# Altium project AD9777.PrjPcb
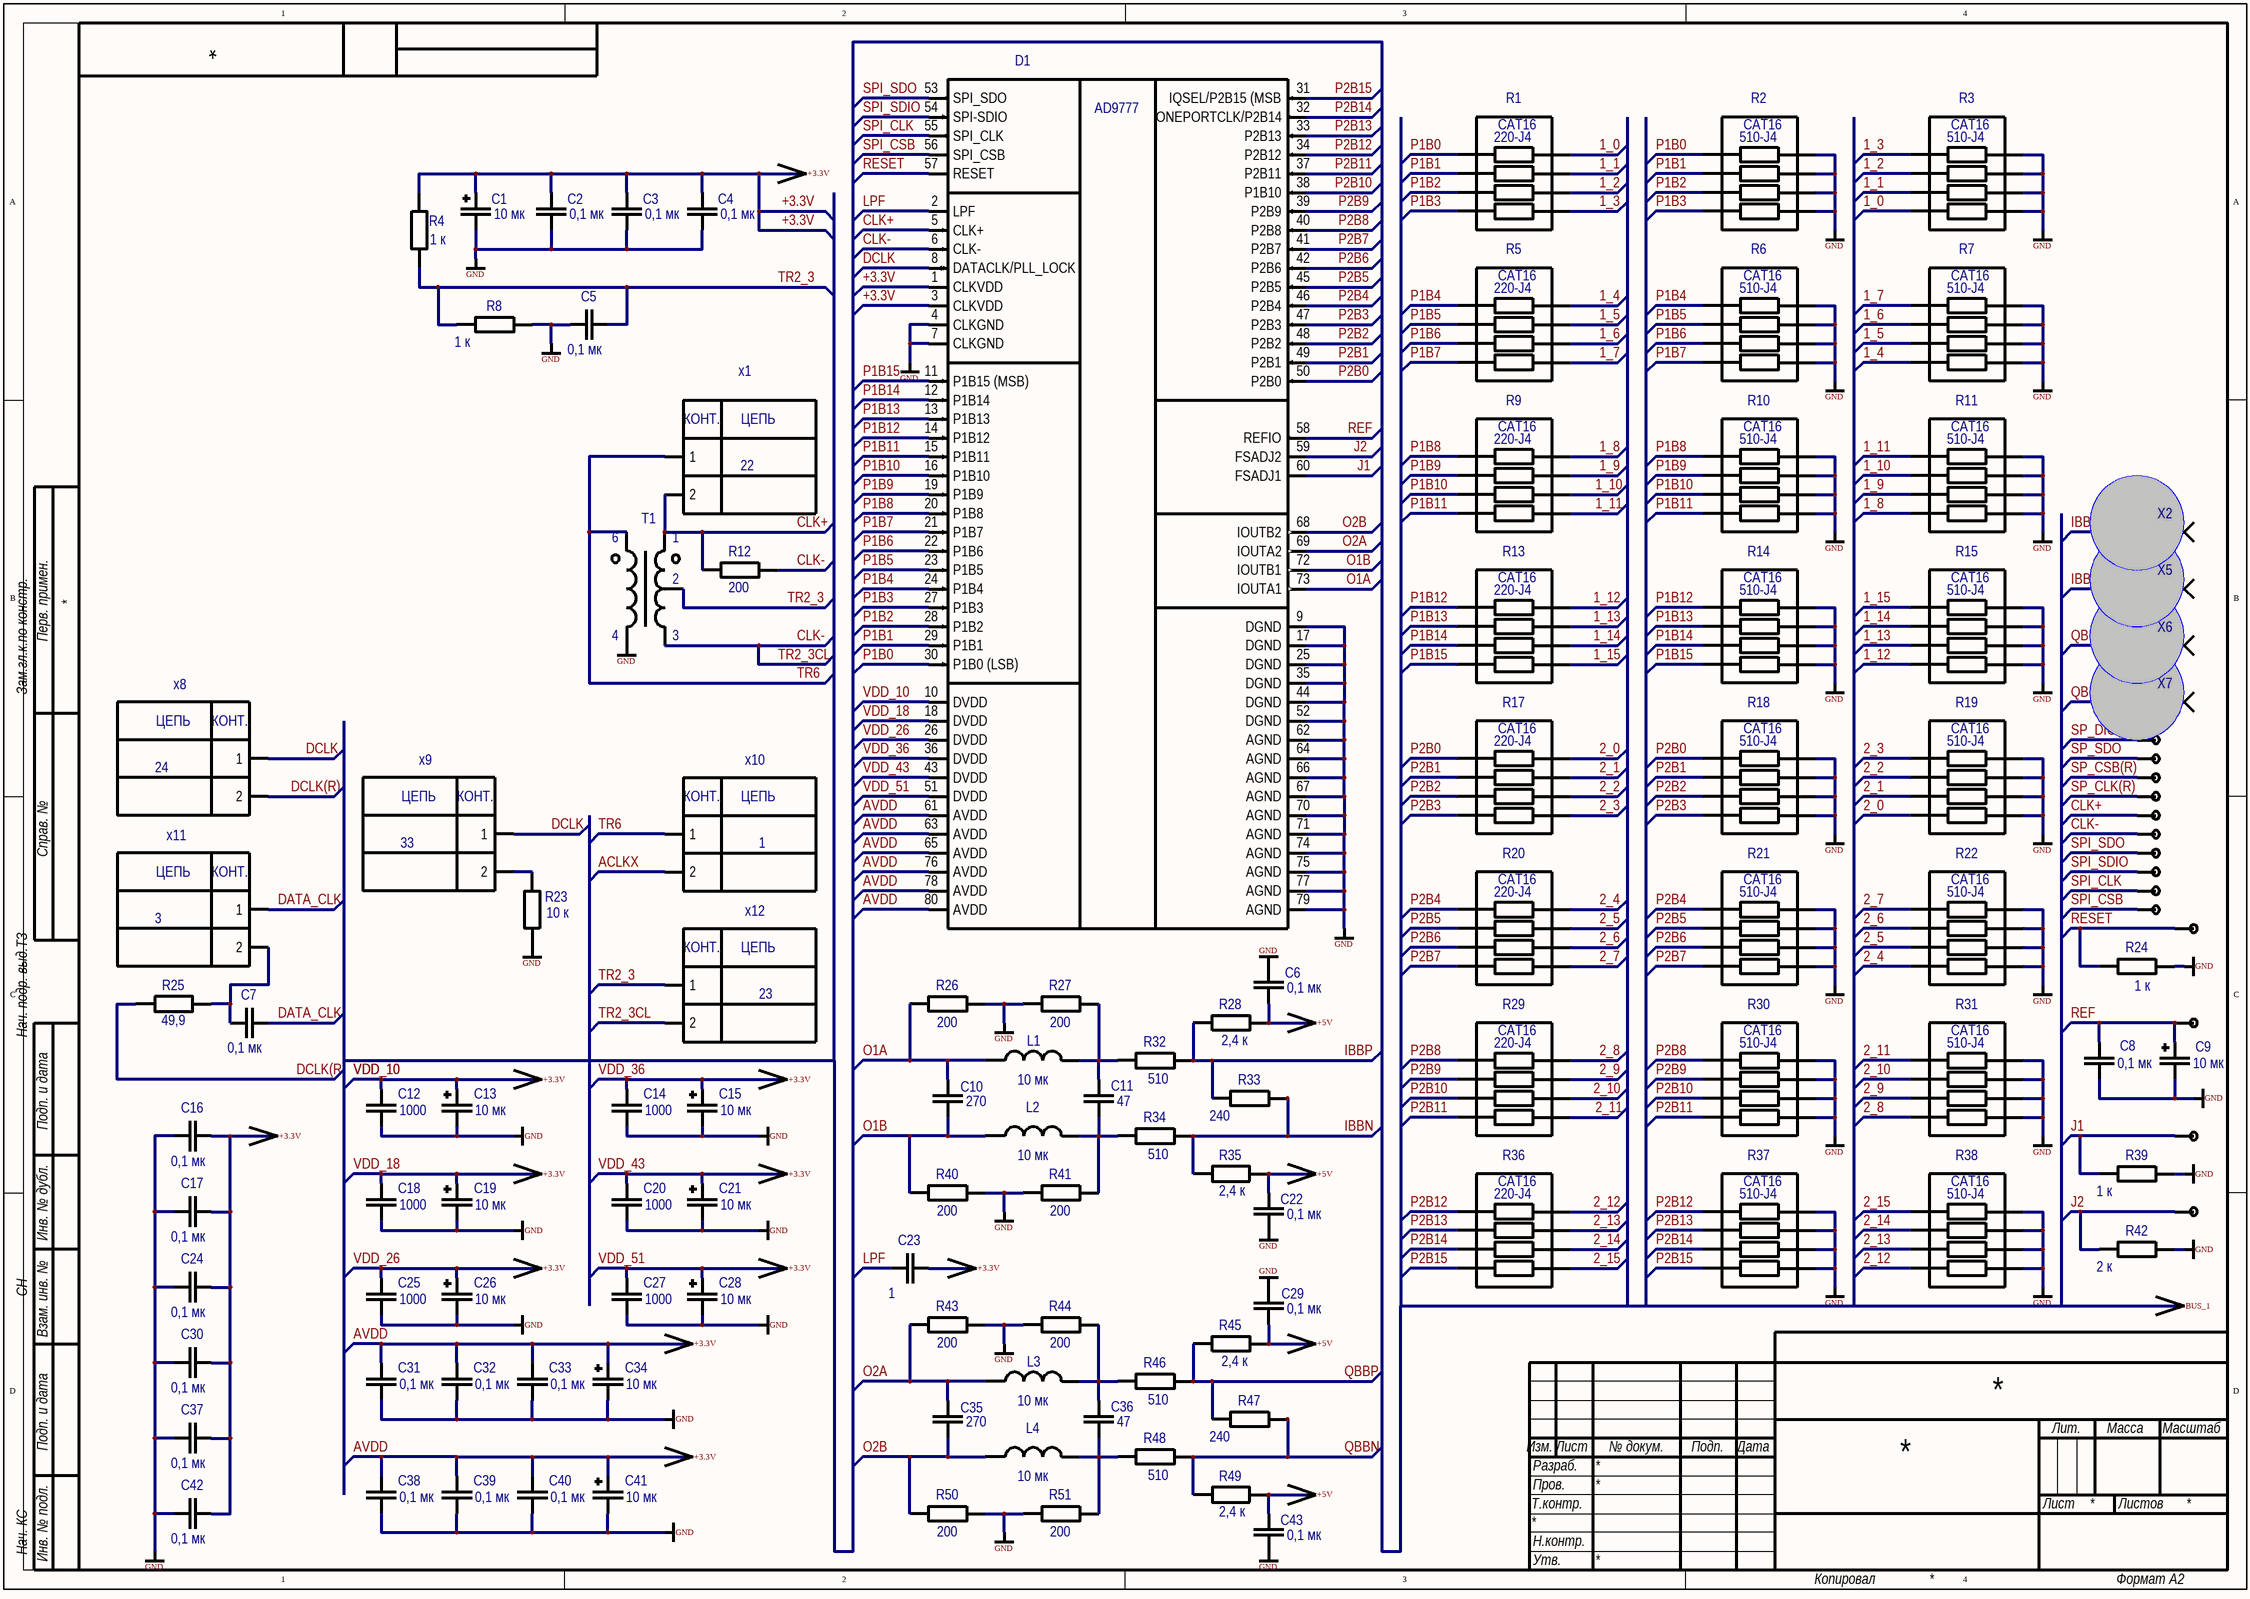
[diagram p0: AD9777.SchDoc]
3 sheets, 235 parts. Net scope: global (net labels, ports and power ports of the same name join across sheets).
Board file: AD9777.PcbDoc
Sheets:
  AD9777.SchDoc
  AD9777(2).SchDoc
  AD9777(3).SchDoc

## Sheet AD9777.SchDoc
size 594 x 420 mm

### Parts
(Parts that share a designator on the sheet are numbered #1, #2 ... from top to bottom, then left to right.)
*?#1  VCC  (value not drawn)  (graphical)
*?#2  GND  (value not drawn)  (graphical)
*?#3  GND  (value not drawn)  (graphical)
*?#4  GND  (value not drawn)  (graphical)
*?#5  GND  (value not drawn)  (graphical)
*?#6  GND  (value not drawn)  (graphical)
*?#7  GND  (value not drawn)  (graphical)
*?#8  GND  (value not drawn)  (graphical)
*?#9  GND  (value not drawn)  (graphical)
*?#10  GND  (value not drawn)  (graphical)
*?#11  GND  (value not drawn)  (graphical)
*?#12  GND  (value not drawn)  (graphical)
*?#13  GND  (value not drawn)  (graphical)
*?#14  GND  (value not drawn)  (graphical)
*?#15  GND  (value not drawn)  (graphical)
*?#16  GND  (value not drawn)  (graphical)
*?#17  GND  (value not drawn)  (graphical)
*?#18  GND  (value not drawn)  (graphical)
*?#19  GND  (value not drawn)  (graphical)
*?#20  GND  (value not drawn)  (graphical)
*?#21  GND  (value not drawn)  (graphical)
*?#22  GND  (value not drawn)  (graphical)
*?#23  VCC  (value not drawn)  (graphical)
*?#24  VCC  (value not drawn)  (graphical)
*?#25  VCC  (value not drawn)  (graphical)
*?#26  GND  (value not drawn)  (graphical)
*?#27  VCC  (value not drawn)  (graphical)
*?#28  GND  (value not drawn)  (graphical)
*?#29  GND  (value not drawn)  (graphical)
*?#30  GND  (value not drawn)  (graphical)
*?#31  GND  (value not drawn)  (graphical)
*?#32  VCC  (value not drawn)  (graphical)
*?#33  VCC  (value not drawn)  (graphical)
*?#34  VCC  (value not drawn)  (graphical)
*?#35  GND  (value not drawn)  (graphical)
*?#36  GND  (value not drawn)  (graphical)
*?#37  GND  (value not drawn)  (graphical)
*?#38  GND  (value not drawn)  (graphical)
*?#39  GND  (value not drawn)  (graphical)
*?#40  GND  (value not drawn)  (graphical)
*?#41  VCC  (value not drawn)  (graphical)
*?#42  VCC  (value not drawn)  (graphical)
*?#43  VCC  (value not drawn)  (graphical)
*?#44  GND  (value not drawn)  (graphical)
*?#45  GND  (value not drawn)  (graphical)
*?#46  GND  (value not drawn)  (graphical)
*?#47  VCC  (value not drawn)  (graphical)
*?#48  GND  (value not drawn)  (graphical)
*?#49  GND  (value not drawn)  (graphical)
*?#50  VCC  (value not drawn)  (graphical)
*?#51  GND  (value not drawn)  (graphical)
*?#52  VCC  (value not drawn)  (graphical)
*?#53  GND  (value not drawn)  (graphical)
*?#54  VCC  (value not drawn)  (graphical)
*?#55  VCC  (value not drawn)  (graphical)
*?#56  GND  (value not drawn)  (graphical)
*?#57  GND  (value not drawn)  (graphical)
*?#58  GND  (value not drawn)  (graphical)
*?#59  GND  (value not drawn)  (graphical)
C1  10 мк  [TC3528-1411]
C2  0,1 мк  [CAPC1608L]
C3  0,1 мк  [CAPC1608L]
C4  0,1 мк  [CAPC1608L]
C5  0,1 мк  [CAPC1608L]
C6  0,1 мк  [CAPC1608L]
C7  0,1 мк  [CAPC1608L]
C8  0,1 мк  [CAPC1608L]
C9  10 мк  [TC3528-1411]
C10  270  [CAPC1608L]
C11  47  [CAPC1608L]
C12  1000  [CAPC1608L]
C13  10 мк  [TC3528-1411]
C14  1000  [CAPC1608L]
C15  10 мк  [TC3528-1411]
C16  0,1 мк  [CAPC2012L]
C17  0,1 мк  [CAPC2012L]
C18  1000  [CAPC1608L]
C19  10 мк  [TC3528-1411]
C20  1000  [CAPC1608L]
C21  10 мк  [TC3528-1411]
C22  0,1 мк  [CAPC1608L]
C23  1  [CAPC1608L]
C24  0,1 мк  [CAPC2012L]
C25  1000  [CAPC1608L]
C26  10 мк  [TC3528-1411]
C27  1000  [CAPC1608L]
C28  10 мк  [TC3528-1411]
C29  0,1 мк  [CAPC1608L]
C30  0,1 мк  [CAPC2012L]
C31  0,1 мк  [CAPC1608L]
C32  0,1 мк  [CAPC1608L]
C33  0,1 мк  [CAPC1608L]
C34  10 мк  [TC3528-1411]
C35  270  [CAPC1608L]
C36  47  [CAPC1608L]
C37  0,1 мк  [CAPC2012L]
C38  0,1 мк  [CAPC1608L]
C39  0,1 мк  [CAPC1608L]
C40  0,1 мк  [CAPC1608L]
C41  10 мк  [TC3528-1411]
C42  0,1 мк  [CAPC2012L]
C43  0,1 мк  [CAPC1608L]
CLK  TP  [TP0.3]  (value not drawn)  (no BOM)
CLK+  TP  [TP0.3]  (value not drawn)  (no BOM)
CLK-  TP  [TP0.3]  (value not drawn)  (no BOM)
CSB  TP  [TP0.3]  (value not drawn)  (no BOM)
D1  AD9777  [QFP50P1400X1400X120-80N]  (value not drawn)
J1  TP  [TP0.3]  (value not drawn)  (no BOM)
J2  TP  [TP0.3]  (value not drawn)  (no BOM)
L1  10 мк  [INDC2012X16N]
L2  10 мк  [INDC2012X16N]
L3  10 мк  [INDC2012X16N]
L4  10 мк  [INDC2012X16N]
R1  CAT16-220-J4  [RESC3216N]  (value not drawn)
R2  CAT16-510-J4  [RESC3216N]  (value not drawn)
R3  CAT16-510-J4  [RESC3216N]  (value not drawn)
R4  1 к  [RESC1608L]
R5  CAT16-220-J4  [RESC3216N]  (value not drawn)
R6  CAT16-510-J4  [RESC3216N]  (value not drawn)
R7  CAT16-510-J4  [RESC3216N]  (value not drawn)
R8  1 к  [RESC1608L]
R9  CAT16-220-J4  [RESC3216N]  (value not drawn)
R10  CAT16-510-J4  [RESC3216N]  (value not drawn)
R11  CAT16-510-J4  [RESC3216N]  (value not drawn)
R12  200  [RESC1608L]
R13  CAT16-220-J4  [RESC3216N]  (value not drawn)
R14  CAT16-510-J4  [RESC3216N]  (value not drawn)
R15  CAT16-510-J4  [RESC3216N]  (value not drawn)
R17  CAT16-220-J4  [RESC3216N]  (value not drawn)
R18  CAT16-510-J4  [RESC3216N]  (value not drawn)
R19  CAT16-510-J4  [RESC3216N]  (value not drawn)
R20  CAT16-220-J4  [RESC3216N]  (value not drawn)
R21  CAT16-510-J4  [RESC3216N]  (value not drawn)
R22  CAT16-510-J4  [RESC3216N]  (value not drawn)
R23  10 к  [RESC1608L]
R24  1 к  [RESC3216L]
R25  49,9  [RESC1608L]
R26  200  [RESC1608L]
R27  200  [RESC1608L]
R28  2,4 к  [RESC1608L]
R29  CAT16-220-J4  [RESC3216N]  (value not drawn)
R30  CAT16-510-J4  [RESC3216N]  (value not drawn)
R31  CAT16-510-J4  [RESC3216N]  (value not drawn)
R32  510  [RESC1608L]
R33  240  [RESC1608L]
R34  510  [RESC1608L]
R35  2,4 к  [RESC1608L]
R36  CAT16-220-J4  [RESC3216N]  (value not drawn)
R37  CAT16-510-J4  [RESC3216N]  (value not drawn)
R38  CAT16-510-J4  [RESC3216N]  (value not drawn)
R39  1 к  [RESC1608L]
R40  200  [RESC1608L]
R41  200  [RESC1608L]
R42  2 к  [RESC1005L]
R43  200  [RESC1608L]
R44  200  [RESC1608L]
R45  2,4 к  [RESC1608L]
R46  510  [RESC1608L]
R47  240  [RESC1608L]
R48  510  [RESC1608L]
R49  2,4 к  [RESC1608L]
R50  200  [RESC1608L]
R51  200  [RESC1608L]
REF  TP  [TP0.3]  (value not drawn)  (no BOM)
RESET  TP  [TP0.3]  (value not drawn)  (no BOM)
SDIO  TP  [TP0.3]  (value not drawn)  (no BOM)
SDO  TP  [TP0.3]  (value not drawn)  (no BOM)
SPI_CLK  TP  [TP0.3]  (value not drawn)  (no BOM)
SPI_CSB  TP  [TP0.3]  (value not drawn)  (no BOM)
SPI_SDIO  TP  [TP0.3]  (value not drawn)  (no BOM)
SPI_SDO  TP  [TP0.3]  (value not drawn)  (no BOM)
T1  TC1-1T+  [TRANS_TC2-1T]  (value not drawn)
x1  PLD2  [PLD-2]  (value not drawn)
X2  22_SMA-50-0-15/111_NE  [TP0.8X1.5]  (value not drawn)
X5  22_SMA-50-0-15/111_NE  [TP0.8X1.5]  (value not drawn)
X6  22_SMA-50-0-15/111_NE  [TP0.8X1.5]  (value not drawn)
X7  22_SMA-50-0-15/111_NE  [TP0.8X1.5]  (value not drawn)
x8  PLD2  [PLD-2]  (value not drawn)
x9  PLD2  [PLD-2]  (value not drawn)
x10  PLD2  [PLD-2]  (value not drawn)
x11  PLD2  [PLD-2]  (value not drawn)
x12  PLD2  [PLD-2]  (value not drawn)

### Nets
+3.3V: C1.2 C2.2 C3.2 C4.2 C12.2 C13.2 C14.2 C15.2 C16.2 C17.2 C18.2 C19.2 C20.2 C21.2 C23.2 C24.2 C25.2 C26.2 C27.2 C28.2 C30.2 C31.2 C32.2 C33.2 C34.2 C37.2 C38.2 C39.2 C40.2 C41.2 C42.2 D1.1(CLKVDD) D1.3(CLKVDD) D1.10(DVDD) D1.18(DVDD) D1.26(DVDD) D1.36(DVDD) D1.43(DVDD) D1.51(DVDD) D1.61(AVDD) D1.63(AVDD) D1.65(AVDD) D1.76(AVDD) D1.78(AVDD) D1.80(AVDD) R4.2  [also labelled AVDD, VDD_10, VDD_18, VDD_26, VDD_36, VDD_43, VDD_51]
+5V: C6.2 C22.2 C29.2 C43.2 R28.1 R35.2 R45.1 R49.2
GND: C1.1 C2.1 C3.1 C4.1 C5.1 C6.1 C8.1 C9.1 C12.1 C13.1 C14.1 C15.1 C16.1 C17.1 C18.1 C19.1 C20.1 C21.1 C22.1 C24.1 C25.1 C26.1 C27.1 C28.1 C29.1 C30.1 C31.1 C32.1 C33.1 C34.1 C37.1 C38.1 C39.1 C40.1 C41.1 C42.1 C43.1 D1.4(CLKGND) D1.7(CLKGND) D1.9(DGND) D1.17(DGND) D1.25(DGND) D1.35(DGND) D1.44(DGND) D1.52(DGND) D1.62(AGND) D1.64(AGND) D1.66(AGND) D1.67(AGND) D1.70(AGND) D1.71(AGND) D1.74(AGND) D1.75(AGND) D1.77(AGND) D1.79(AGND) D1.EPAD(GND) R2.5 R2.6 R2.7 R2.8 R3.5 R3.6 R3.7 R3.8 R6.5 R6.6 R6.7 R6.8 R7.5 R7.6 R7.7 R7.8 R8.2 R10.5 R10.6 R10.7 R10.8 R11.5 R11.6 R11.7 R11.8 R14.5 R14.6 R14.7 R14.8 R15.5 R15.6 R15.7 R15.8 R18.5 R18.6 R18.7 R18.8 R19.5 R19.6 R19.7 R19.8 R21.5 R21.6 R21.7 R21.8 R22.5 R22.6 R22.7 R22.8 R23.2 R24.2 R26.2 R27.1 R30.5 R30.6 R30.7 R30.8 R31.5 R31.6 R31.7 R31.8 R37.5 R37.6 R37.7 R37.8 R38.5 R38.6 R38.7 R38.8 R39.2 R40.2 R41.1 R42.2 R43.2 R44.1 R50.2 R51.1 T1.4
1_0: R1.8 R3.4
1_1: R1.7 R3.3
1_2: R1.6 R3.2
1_3: R1.5 R3.1
1_4: R5.8 R7.4
1_5: R5.7 R7.3
1_6: R5.6 R7.2
1_7: R5.5 R7.1
1_8: R9.8 R11.4
1_9: R9.7 R11.3
1_10: R9.6 R11.2
1_11: R9.5 R11.1
1_12: R13.8 R15.4
1_13: R13.7 R15.3
1_14: R13.6 R15.2
1_15: R13.5 R15.1
2_0: R17.8 R19.4
2_1: R17.7 R19.3
2_2: R17.6 R19.2
2_3: R17.5 R19.1
2_4: R20.8 R22.4
2_5: R20.7 R22.3
2_6: R20.6 R22.2
2_7: R20.5 R22.1
2_8: R29.8 R31.4
2_9: R29.7 R31.3
2_10: R29.6 R31.2
2_11: R29.5 R31.1
2_12: R36.8 R38.4
2_13: R36.7 R38.3
2_14: R36.6 R38.2
2_15: R36.5 R38.1
ACLKX: x10.2
CLK+: CLK+.1 D1.5(CLK+) R12.1 T1.1 x1.2
CLK-: CLK-.1 D1.6(CLK-) R12.2 T1.3 x12.2  [also labelled TR2_3CL]
DATA_CLK: C7.1 x11.1
DCLK: D1.8(DATACLK/PLL_LOCK) x8.1 x9.1
DCLK(R): R25.2 x8.2
IBBN: R33.2 R34.2 R35.1 X5.1
IBBP: R28.2 R32.2 R33.1 X2.1
J1: D1.60(FSADJ1) J1.1 R39.1
J2: D1.59(FSADJ2) J2.1 R42.1
LPF: C23.1 D1.2(LPF)
O1A: C10.2 D1.73(IOUTA1) L1.1 R26.1
O1B: C10.1 D1.72(IOUTB1) L2.1 R40.1
O2A: C35.2 D1.69(IOUTA2) L3.1 R43.1
O2B: C35.1 D1.68(IOUTB2) L4.1 R50.1
P1B0: D1.30(P1B0_(LSB)) R1.1 R2.1
P1B1: D1.29(P1B1) R1.2 R2.2
P1B2: D1.28(P1B2) R1.3 R2.3
P1B3: D1.27(P1B3) R1.4 R2.4
P1B4: D1.24(P1B4) R5.1 R6.1
P1B5: D1.23(P1B5) R5.2 R6.2
P1B6: D1.22(P1B6) R5.3 R6.3
P1B7: D1.21(P1B7) R5.4 R6.4
P1B8: D1.20(P1B8) R9.1 R10.1
P1B9: D1.19(P1B9) R9.2 R10.2
P1B10: D1.16(P1B10) R9.3 R10.3
P1B11: D1.15(P1B11) R9.4 R10.4
P1B12: D1.14(P1B12) R13.1 R14.1
P1B13: D1.13(P1B13) R13.2 R14.2
P1B14: D1.12(P1B14) R13.3 R14.3
P1B15: D1.11(P1B15_(MSB)) R13.4 R14.4
P2B0: D1.50(P2B0) R17.1 R18.1
P2B1: D1.49(P2B1) R17.2 R18.2
P2B2: D1.48(P2B2) R17.3 R18.3
P2B3: D1.47(P2B3) R17.4 R18.4
P2B4: D1.46(P2B4) R20.1 R21.1
P2B5: D1.45(P2B5) R20.2 R21.2
P2B6: D1.42(P2B6) R20.3 R21.3
P2B7: D1.41(P2B7) R20.4 R21.4
P2B8: D1.40(P2B8) R29.1 R30.1
P2B9: D1.39(P2B9) R29.2 R30.2
P2B10: D1.38(P1B10) R29.3 R30.3
P2B11: D1.37(P2B11) R29.4 R30.4
P2B12: D1.34(P2B12) R36.1 R37.1
P2B13: D1.33(P2B13) R36.2 R37.2
P2B14: D1.32(ONEPORTCLK/P2B14) R36.3 R37.3
P2B15: D1.31(IQSEL/P2B15_(MSB) R36.4 R37.4
QBBN: R47.2 R48.2 R49.1 X7.1
QBBP: R45.2 R46.2 R47.1 X6.1
REF: C8.2 C9.2 D1.58(REFIO) REF.1
RESET: D1.57(RESET) R24.1 RESET.1
SP_CLK(R): SPI_CLK.1
SP_CSB(R): SPI_CSB.1
SP_DIO(R): SPI_SDIO.1
SP_SDO: SPI_SDO.1
SPI_CLK: CLK.1 D1.55(SPI_CLK)
SPI_CSB: CSB.1 D1.56(SPI_CSB)
SPI_SDIO: D1.54(SPI-SDIO) SDIO.1
SPI_SDO: D1.53(SPI_SDO) SDO.1
TR2_3: C5.2 R4.1 R8.1 T1.2 x12.1
TR6: T1.6 x1.1 x10.1
NetC7_2: C7.2 R25.1 x11.2
NetC11_1: C11.1 L2.2 R34.1 R41.2
NetC11_2: C11.2 L1.2 R27.2 R32.1
NetC36_1: C36.1 L4.2 R48.1 R51.2
NetC36_2: C36.2 L3.2 R44.2 R46.1
NetR23_1: R23.1 x9.2

### Notes on the sheet
- 22
- 24
- 33
- 1
- 3
- 23
- Labels drawn without touching a wire or pin: BUS_1
- Перв. примен.
- Зам.гл.к.по констр.
- Справ. №
- Нач. подр. выд.ТЗ
- Подп. и дата
- Инв. № дубл.
- СН
- Взам. инв. №
- Изм.
- Лист
- № докум.
- Подп.
- Дата
- Лит.
- Масса
- Масштаб
- Т.контр.
- Пров.
- Разраб.
- Листов
- Нач. КС
- Инв. № подл.
- Н.контр.
- Утв.
- Копировал
- Формат А2
- (in symbol CAT16-220-J4) CAT16; 220-J4
- (in symbol CAT16-510-J4) CAT16; 510-J4
- (in symbol PLD2) КОНТ.; ЦЕПЬ

### Library data of the parts
*?#1 *?#23-*?#25 *?#27 *?#32-*?#34 *?#41-*?#43 *?#47 *?#50 *?#52 *?#54 *?#55 = VCC: Порт ЕСКД. Для "наложения" на штатный Power Bar
*?#2-*?#22 *?#26 *?#28-*?#31 *?#35-*?#40 *?#44-*?#46 *?#48 *?#49 *?#51 *?#53 *?#56-*?#59 = GND: Корпус ЕСКД. Для "наложения" на штатный Power Bar
C1 = i6124B5A087030000003: Танталовый конденсатор; ManufacturerPartNumber: К53-67-16 В-10 мкФ ±10 %; Power/Voltage: 16 В; Tolerance: ±10 %; PCADSymbol: TAJ; PCADLibrary: PASSIV.LIB; TU/GOST: АЖЯР.673546.006 ТУ; BCPId: *; Manufacturer: *; Name: TAJB; TKE/TKC: *; Type: Конденсатор; Value: 10 мк; ImKey: i6124B5A087030000003; PCADType: TAJB; PCADPattern: TAJB
C2-C8 C22 C29 C31-C33 C38-C40 C43 = i6124B5A08701E000001: Чип-конденсатор; ManufacturerPartNumber: 0603 X7R 0,1 мкФ ±10 % 50 В; Name: 0603; Power/Voltage: 50 В; TKE/TKC: {TKE/TKC}; Tolerance: ±10 %; PCADSymbol: C; PCADLibrary: PASSIV.LIB; BCPId: *; Manufacturer: *; Type: Конденсатор; Value: 0,1 мк; ImKey: i6124B5A08701E000001; PCADType: C0603; PCADPattern: C0603
C9 C13 C15 C19 C21 C26 C28 C34 C41 = i6124B5A0871D6000003: Танталовый конденсатор; ManufacturerPartNumber: К53-68 "B"-16 В-10 мкФ ±10 %; Power/Voltage: 16 В; Tolerance: ±10 %; PCADSymbol: TAJ; PCADLibrary: PASSIV.LIB; TU/GOST: АЖЯР.673546.007 ТУ; BCPId: *; Manufacturer: *; Name: TAJB; TKE/TKC: *; Type: Конденсатор; Value: 10 мк; ImKey: i6124B5A0871D6000003; PCADType: TAJB; PCADPattern: TAJB
C10 C35 = i6124B5A08701A00002C: Чип-конденсатор; ManufacturerPartNumber: 0603 NP0 270 пФ ±5 % 50 В; Name: 0603; Power/Voltage: 50 В; TKE/TKC: {TKE/TKC}; Tolerance: ±5 %; PCADSymbol: C; PCADLibrary: PASSIV.LIB; BCPId: *; Manufacturer: *; Type: Конденсатор; Value: 270; ImKey: i6124B5A08701A00002C; PCADType: C0603; PCADPattern: C0603
C11 C36 = i6124B5A08740B000012: Чип-конденсатор; ManufacturerPartNumber: GRM1885C1H470GA01 (0603 C0G 47 пФ ±2 % 50 В); Name: 0603; Power/Voltage: 50 В; TKE/TKC: {TKE/TKC}; Tolerance: ±2 %; PCADSymbol: C; PCADLibrary: PASSIV.LIB; BCPId: *; Manufacturer: *; Type: Конденсатор; Value: 47; ImKey: i6124B5A08740B000012; PCADType: C0603; PCADPattern: C0603
C12 C14 C18 C20 C25 C27 = i6124B5A08701E000003: Чип-конденсатор; ManufacturerPartNumber: 0603 X7R 1000 пФ ±10 % 50 В; Name: 0603; Power/Voltage: 50 В; TKE/TKC: {TKE/TKC}; Tolerance: ±10 %; PCADSymbol: C; PCADLibrary: PASSIV.LIB; BCPId: *; Manufacturer: *; Type: Конденсатор; Value: 1000; ImKey: i6124B5A08701E000003; PCADType: C0603; PCADPattern: C0603
C16 C17 C24 C30 C37 C42 = i6124B5A0870C4000003: Чип-конденсатор; ManufacturerPartNumber: 0805 X7R 0,1 мкФ ±10 % 50 В; Name: 0805; Power/Voltage: 50 В; TKE/TKC: {TKE/TKC}; Tolerance: ±10 %; PCADSymbol: C; PCADLibrary: PASSIV.LIB; BCPId: *; Manufacturer: *; Type: Конденсатор; Value: 0,1 мк; ImKey: i6124B5A0870C4000003; PCADType: C0805; PCADPattern: C0805
C23 = i6124B5A08701A00001C: Чип-конденсатор; ManufacturerPartNumber: 0603 NP0 1 пФ ±0,1 пФ 50 В; Name: 0603; Power/Voltage: 50 В; TKE/TKC: {TKE/TKC}; Tolerance: ±0,1 пФ; PCADSymbol: C; PCADLibrary: PASSIV.LIB; BCPId: *; Manufacturer: *; Type: Конденсатор; Value: 1; ImKey: i6124B5A08701A00001C; PCADType: C0603; PCADPattern: C0603
CLK CLK+ CLK- CSB J1 J2 REF RESET SDIO SDO SPI_CLK SPI_CSB SPI_SDIO SPI_SDO = TP: Test point
D1 = AD9777: 16-Bit, 160 MSPS 2x/4x/8x  Interpolating Dual TxDAC+® D/A Converter; Manufacturer: Analog Devices; Type: Микросхема; BCPId: *; Name: *; Package: SV-80-1; ManufacturerPartNumber: AD9777; HelpURL: *; Price: *; Rem: *; TU/GOST: *; SymAuthor: *
L1-L4 = i6124B5A087254000001: Индуктивность без магнитопровода; ManufacturerPartNumber: 0805LS-103XJL (10 мкГн ±5 % ); Name: 0805; Tolerance: ±5 %; PCADType: 0805 LS; PCADSymbol: KAT; PCADPattern: L-0805; PCADLibrary: PASSIV.LIB; BCPId: *; Manufacturer: *; Package: *; Type: Индуктивность; Value: 10 мк; ImKey: i6124B5A087254000001
R1 R5 R9 R13 R17 R20 R29 R36 = CAT16-220-J4: Резисторная сборка 4х22Ом; Name: 1206; Tolerance: 5%; BCPId: *; Manufacturer: *; ManufacturerPartNumber: CAT16-220-J4; Type: Резистор
R2 R3 R6 R7 R10 R11 R14 R15 R18 R19 R21 R22 R30 R31 R37 R38 = CAT16-510-J4: Резисторная сборка 4х51Ом; Name: 1206; Tolerance: 5%; BCPId: *; Manufacturer: *; ManufacturerPartNumber: CAT16-510-J4; Type: Резистор
R4 R8 = i6124B5A08707A000008: Чип-резистор; ManufacturerPartNumber: Р1-12-0,1-1 кОм ±5 % - Т; Name: 0603; Tolerance: ±5 %; Power/Voltage: 0,1 Вт; TU/GOST: АЛЯР.434110.005 ТУ; BCPId: *; Manufacturer: *; Type: Резистор; Value: 1 к; ImKey: i6124B5A08707A000008
R12 R26 R27 R40 R41 R43 R44 R50 R51 = i6124B5A08707A000011: Чип-резистор; ManufacturerPartNumber: Р1-12-0,1-200 Ом ±5 % - Т; Name: 0603; Tolerance: ±5 %; Power/Voltage: 0,1 Вт; TU/GOST: АЛЯР.434110.005 ТУ; BCPId: *; Manufacturer: *; Type: Резистор; Value: 200; ImKey: i6124B5A08707A000011
R23 = i6124B5A08707A000001: Чип-резистор; ManufacturerPartNumber: Р1-12-0,1-10 кОм ±5 % - Т; Name: 0603; Tolerance: ±5 %; Power/Voltage: 0,1 Вт; TU/GOST: АЛЯР.434110.005 ТУ; BCPId: *; Manufacturer: *; Type: Резистор; Value: 10 к; ImKey: i6124B5A08707A000001
R24 = i6124B5A0870AA00000F: Чип-резистор; ManufacturerPartNumber: Р1-12-0,25-1 кОм ±5 % - Т; Name: 1206; Tolerance: ±5 %; Power/Voltage: 0,25 Вт; TU/GOST: АЛЯР.434110.005 ТУ; BCPId: *; Manufacturer: *; Type: Резистор; Value: 1 к; ImKey: i6124B5A0870AA00000F
R25 = i6124B5A08741A00000E: Чип-резистор; ManufacturerPartNumber: Р1-12-0,1-49,9 Ом ±1 % - Т; Name: 0603; Tolerance: ±1 %; Power/Voltage: 0,1 Вт; TU/GOST: АЛЯР.434110.005 ТУ; BCPId: *; Manufacturer: *; Type: Резистор; Value: 49,9; ImKey: i6124B5A08741A00000E
R28 R35 R45 R49 = i6124B5A08707A000035: Чип-резистор; ManufacturerPartNumber: Р1-12-0,1-2,4 кОм ±5 % - Т; Name: 0603; Tolerance: ±5 %; Power/Voltage: 0,1 Вт; TU/GOST: АЛЯР.434110.005 ТУ; BCPId: *; Manufacturer: *; Type: Резистор; Value: 2,4 к; ImKey: i6124B5A08707A000035
R32 R34 R46 R48 = i6124B5A08707A000028: Чип-резистор; ManufacturerPartNumber: Р1-12-0,1-510 Ом ±5 % - Т; Name: 0603; Tolerance: ±5 %; Power/Voltage: 0,1 Вт; TU/GOST: АЛЯР.434110.005 ТУ; BCPId: *; Manufacturer: *; Type: Резистор; Value: 510; ImKey: i6124B5A08707A000028
R33 R47 = i6124B5A08707A000022: Чип-резистор; ManufacturerPartNumber: Р1-12-0,1-240 Ом ±5 % - Т; Name: 0603; Tolerance: ±5 %; Power/Voltage: 0,1 Вт; TU/GOST: АЛЯР.434110.005 ТУ; BCPId: *; Manufacturer: *; Type: Резистор; Value: 240; ImKey: i6124B5A08707A000022
R39 = i6124B5A0874E400000B: Чип-резистор; ManufacturerPartNumber: Р1-8МП-0,1-1 кОм ±1 %; Name: 0603; Tolerance: ±1 %; Power/Voltage: 0,1 Вт; TU/GOST: ОЖ0.467.164 ТУ; BCPId: *; Manufacturer: *; Type: Резистор; Value: 1 к; ImKey: i6124B5A0874E400000B
R42 = i6124B5A08765B00004D: Чип-резистор; ManufacturerPartNumber: Р1-12-0,062-2 кОм ±1 % - Т - "А"; Name: 0402; Tolerance: ±1 %; Power/Voltage: 0,062 Вт; TU/GOST: АЛЯР.434110.005 ТУ; BCPId: *; Manufacturer: *; Type: Резистор; Value: 2 к; ImKey: i6124B5A08765B00004D
T1 = TC1-1T+: Трансформатор; Manufacturer*: Mini-Circuits; BCPId: *; Type: Трансформатор; ManufacturerPartNumber: TC1-1T+; Package: AT224
x1 x8-x12 = PLD2: Штыри на плату, шаг 2.54мм.; BCPId: *; ManufacturerPartNumber: PLD2; Rem: *; Package: *; TU/GOST: *; Type: Вилка; HelpURL: *; Price: *
X2 X5-X7 = 22_SMA-50-0-15/111_NE: Розетка герметичная; Manufacturer: HUBER+SUHNER; BCPId: *; ManufacturerPartNumber: 22_SMA-50-0-15/111_NE; Type: Розетка

## Sheet AD9777(2).SchDoc
size 420 x 297 mm
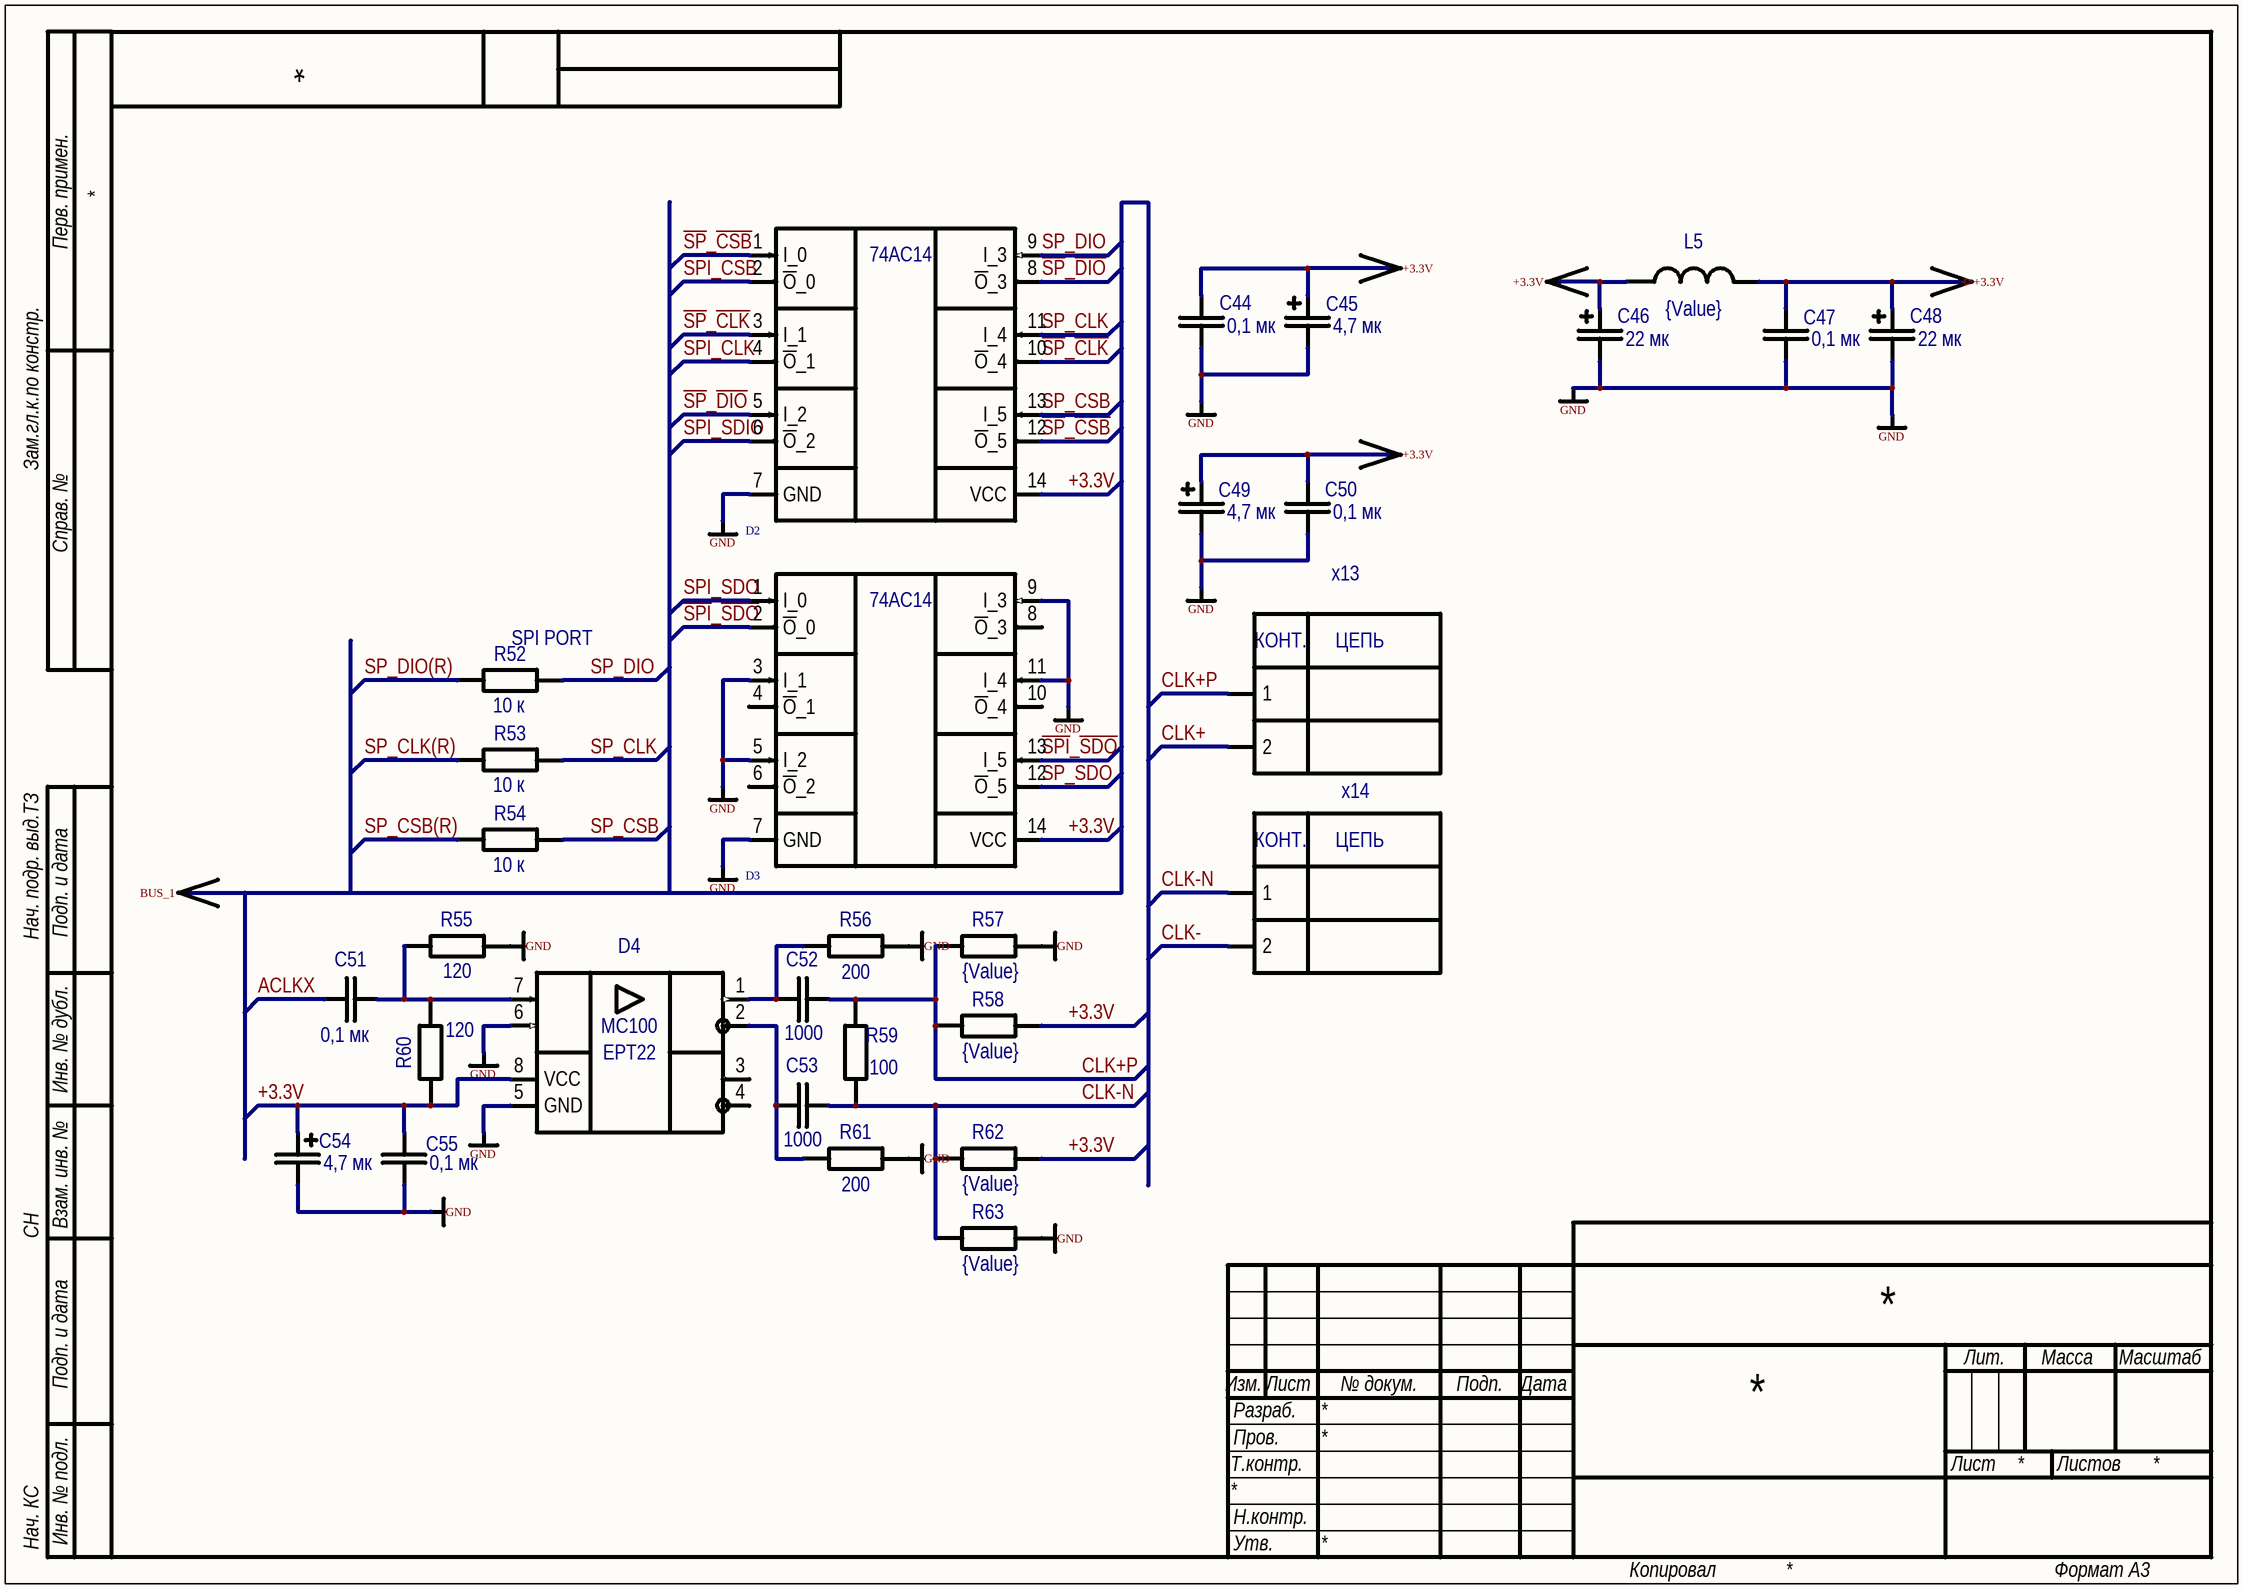
[diagram p1: AD9777(2).SchDoc]

### Parts
(Parts that share a designator on the sheet are numbered #1, #2 ... from top to bottom, then left to right.)
*?#60  VCC  (value not drawn)  (graphical)
*?#61  VCC  (value not drawn)  (graphical)
*?#62  VCC  (value not drawn)  (graphical)
*?#63  GND  (value not drawn)  (graphical)
*?#64  GND  (value not drawn)  (graphical)
*?#65  GND  (value not drawn)  (graphical)
*?#66  VCC  (value not drawn)  (graphical)
*?#67  GND  (value not drawn)  (graphical)
*?#68  GND  (value not drawn)  (graphical)
*?#69  GND  (value not drawn)  (graphical)
*?#70  GND  (value not drawn)  (graphical)
*?#71  GND  (value not drawn)  (graphical)
*?#72  VCC  (value not drawn)  (graphical)
*?#73  GND  (value not drawn)  (graphical)
*?#74  GND  (value not drawn)  (graphical)
*?#75  GND  (value not drawn)  (graphical)
*?#76  GND  (value not drawn)  (graphical)
*?#77  GND  (value not drawn)  (graphical)
*?#78  GND  (value not drawn)  (graphical)
*?#79  GND  (value not drawn)  (graphical)
*?#80  GND  (value not drawn)  (graphical)
C44  0,1 мк  [CAPC2012L]
C45  4,7 мк  [TC3216-1206]
C46  22 мк  [TC3528-1411]
C47  0,1 мк  [CAPC2012L]
C48  22 мк  [TC3528-1411]
C49  4,7 мк  [TC3216-1206]
C50  0,1 мк  [CAPC2012L]
C51  0,1 мк  [CAPC2012L]
C52  1000  [CAPC1608L]
C53  1000  [CAPC1608L]
C54  4,7 мк  [TC3216-1206]
C55  0,1 мк  [CAPC2012L]
D2  74AC14  [SOIC127P600X175-14N]  (value not drawn)
D3  74AC14  [SOIC127P600X175-14N]  (value not drawn)
D4  MC100EPT22  [TSSOP50P490X110-10N]  (value not drawn)
L5  {Value}  [INDC3225L]
R52  10 к  [RESC1608L]
R53  10 к  [RESC1608L]
R54  10 к  [RESC1608L]
R55  120  [RESC1608L]
R56  200  [RESC2012L]
R57  {Value}  [RESC2012L]
R58  {Value}  [RESC2012L]
R59  100  [RESC1608L]
R60  120  [RESC1608L]
R61  200  [RESC2012L]
R62  {Value}  [RESC2012L]
R63  {Value}  [RESC2012L]
x13  PLD2  [PLD-2]  (value not drawn)
x14  PLD2  [PLD-2]  (value not drawn)

### Nets
+3.3V: C44.2 C45.2 C46.2 C47.2 C48.2 C49.2 C50.2 C54.2 C55.2 D2.14(VCC) D3.14(VCC) D4.8(VCC) L5.1 L5.2 R58.2 R60.1 R62.2
GND: C44.1 C45.1 C46.1 C47.1 C48.1 C49.1 C50.1 C54.1 C55.1 D2.7(GND) D3.3(I_1) D3.5(I_2) D3.7(GND) D3.9(I_3) D3.11(I_4) D4.5(GND) D4.6(D_1) R55.2 R56.2 R57.2 R61.2 R63.2
ACLKX: C51.1
CLK+: x13.2
CLK+P: C52.2 R57.1 R58.1 R59.2 x13.1
CLK-: x14.2
CLK-N: C53.2 R59.1 R62.1 R63.1 x14.1
~{SP}_~{CLK}: D2.3(I_1) D2.10(~{O}_4)
~{SP}_~{CSB}: D2.1(I_0) D2.12(~{O}_5)
~{SP}_~{DIO}: D2.5(I_2) D2.8(~{O}_3)
~{SPI}_~{SDO}: D3.2(~{O}_0) D3.13(I_5)
SP_CLK: D2.11(I_4) R53.2
SP_CLK(R): R53.1
SP_CSB: D2.13(I_5) R54.2
SP_CSB(R): R54.1
SP_DIO: D2.9(I_3) R52.2
SP_DIO(R): R52.1
SP_SDO: D3.12(~{O}_5)
SPI_CLK: D2.4(~{O}_1)
SPI_CSB: D2.2(~{O}_0)
SPI_SDIO: D2.6(~{O}_2)
SPI_SDO: D3.1(I_0)
NetC51_2: C51.2 D4.7(D_0) R55.1 R60.2
NetC52_1: C52.1 D4.1(Q_0) R56.1
NetC53_1: C53.1 D4.2(~{Q}_0) R61.1

Not connected (* = marked no-connect by the designer): D3 4(~{O}_1) 6(~{O}_2) 8(~{O}_3) 10(~{O}_4); D4 3(Q_1) 4(~{Q}_1)

### Notes on the sheet
- (near R52) SPI PORT
- Labels drawn without touching a wire or pin: BUS_1
- Перв. примен.
- Зам.гл.к.по констр.
- Справ. №
- Нач. подр. выд.ТЗ
- Подп. и дата
- Инв. № дубл.
- Взам. инв. №
- СН
- Изм.
- Лист
- № докум.
- Подп.
- Дата
- Лит.
- Масса
- Масштаб
- Т.контр.
- Пров.
- Разраб.
- Листов
- Нач. КС
- Инв. № подл.
- Н.контр.
- Утв.
- Копировал
- Формат А3
- (in symbol MC100EPT22) MC100; EPT22
- (in symbol PLD2) КОНТ.; ЦЕПЬ

### Library data of the parts
*?#60-*?#62 *?#66 *?#72 = VCC: as *?#1 on sheet AD9777
*?#63-*?#65 *?#67-*?#71 *?#73-*?#80 = GND: as *?#2 on sheet AD9777
C44 C47 C50 C51 C55 = i6124B5A0870C4000003: as C16 on sheet AD9777; BCPId: *; Manufacturer: *; Type: Конденсатор; Value: 0,1 мк; ImKey: i6124B5A0870C4000003; PCADType: C0805; PCADPattern: C0805
C45 C49 C54 = i6124B5A087028000009: Танталовый конденсатор; ManufacturerPartNumber: TAJA475M025RNJ (4,7 мкФ ±20 % 25 В); Power/Voltage: 25 В; Tolerance: ±20 %; PCADSymbol: TAJ; PCADLibrary: PASSIV.LIB; BCPId: *; Manufacturer: *; Name: TAJA; TKE/TKC: *; Type: Конденсатор; Value: 4,7 мк; ImKey: i6124B5A087028000009; PCADType: TAJA; PCADPattern: TAJA
C46 C48 = i6124B5A087041000004: Танталовый конденсатор; ManufacturerPartNumber: TAJB226M020RNJ (22 мкФ ±20 % 20 В); Power/Voltage: 20 В; Tolerance: ±20 %; PCADSymbol: TAJ; PCADLibrary: PASSIV.LIB; BCPId: *; Manufacturer: *; Name: TAJB; TKE/TKC: *; Type: Конденсатор; Value: 22 мк; ImKey: i6124B5A087041000004; PCADType: TAJB; PCADPattern: TAJB
C52 C53 = i6124B5A08701E000003: as C12 on sheet AD9777; BCPId: *; Manufacturer: *; Type: Конденсатор; Value: 1000; ImKey: i6124B5A08701E000003; PCADType: C0603; PCADPattern: C0603
D2 D3 = 74AC14: Hex Inverter Schmitt  Trigger; Manufacturer: Fairchild Semiconductor; Type: Микросхема; ManufacturerPartNumber: 74AC14; Package: SOIC
D4 = MC100EPT22: 3.3V Dual LVTTL/LVCMOS to Differential LVPECL Translator; Manufacturer: On Semiconductor; Type: Микросхема; BCPId: *; Name: *; Package: TSSOP-8; ManufacturerPartNumber: MC100EPT22
L5 = L1210: Индуктивность без магнитопровода; Name: 1210; Tolerance: {Tolerance}; BCPId: *; Manufacturer: *; Package: *; ManufacturerPartNumber: *; Type: Индуктивность; Value: {Value}
R52-R54 = i6124B5A08707A000001: as R23 on sheet AD9777; BCPId: *; Manufacturer: *; Type: Резистор; Value: 10 к; ImKey: i6124B5A08707A000001
R55 R60 = i6124B5A08707A000041: Чип-резистор; ManufacturerPartNumber: Р1-12-0,1-120 Ом ±5 % - Т; Name: 0603; Tolerance: ±5 %; Power/Voltage: 0,1 Вт; TU/GOST: АЛЯР.434110.005 ТУ; BCPId: *; Manufacturer: *; Type: Резистор; Value: 120; ImKey: i6124B5A08707A000041
R56 R61 = i6124B5A0870A7000031: Чип-резистор; ManufacturerPartNumber: Р1-12-0,125-200 Ом ±5 % - Т; Name: 0805; Tolerance: ±5 %; Power/Voltage: 0,125 Вт; TU/GOST: АЛЯР.434110.005 ТУ; BCPId: *; Manufacturer: *; Type: Резистор; Value: 200; ImKey: i6124B5A0870A7000031
R57 R58 R62 R63 = R0805: Чип-резистор; Name: 0805; Tolerance: {Tolerance}; BCPId: *; Manufacturer: *; ManufacturerPartNumber: *; Type: Резистор; Value: {Value}
R59 = i6124B5A08707A000021: Чип-резистор; ManufacturerPartNumber: Р1-12-0,1-100 Ом ±5 % - Т; Name: 0603; Tolerance: ±5 %; Power/Voltage: 0,1 Вт; TU/GOST: АЛЯР.434110.005 ТУ; BCPId: *; Manufacturer: *; Type: Резистор; Value: 100; ImKey: i6124B5A08707A000021
x13 x14 = PLD2: Штыри на плату, шаг 2.54мм.; BCPId: *; ManufacturerPartNumber: PLD2; Rem: *; Package: *; TU/GOST: *; Type: Вилка; HelpURL: *; Price: *

## Sheet AD9777(3).SchDoc
size 420 x 297 mm
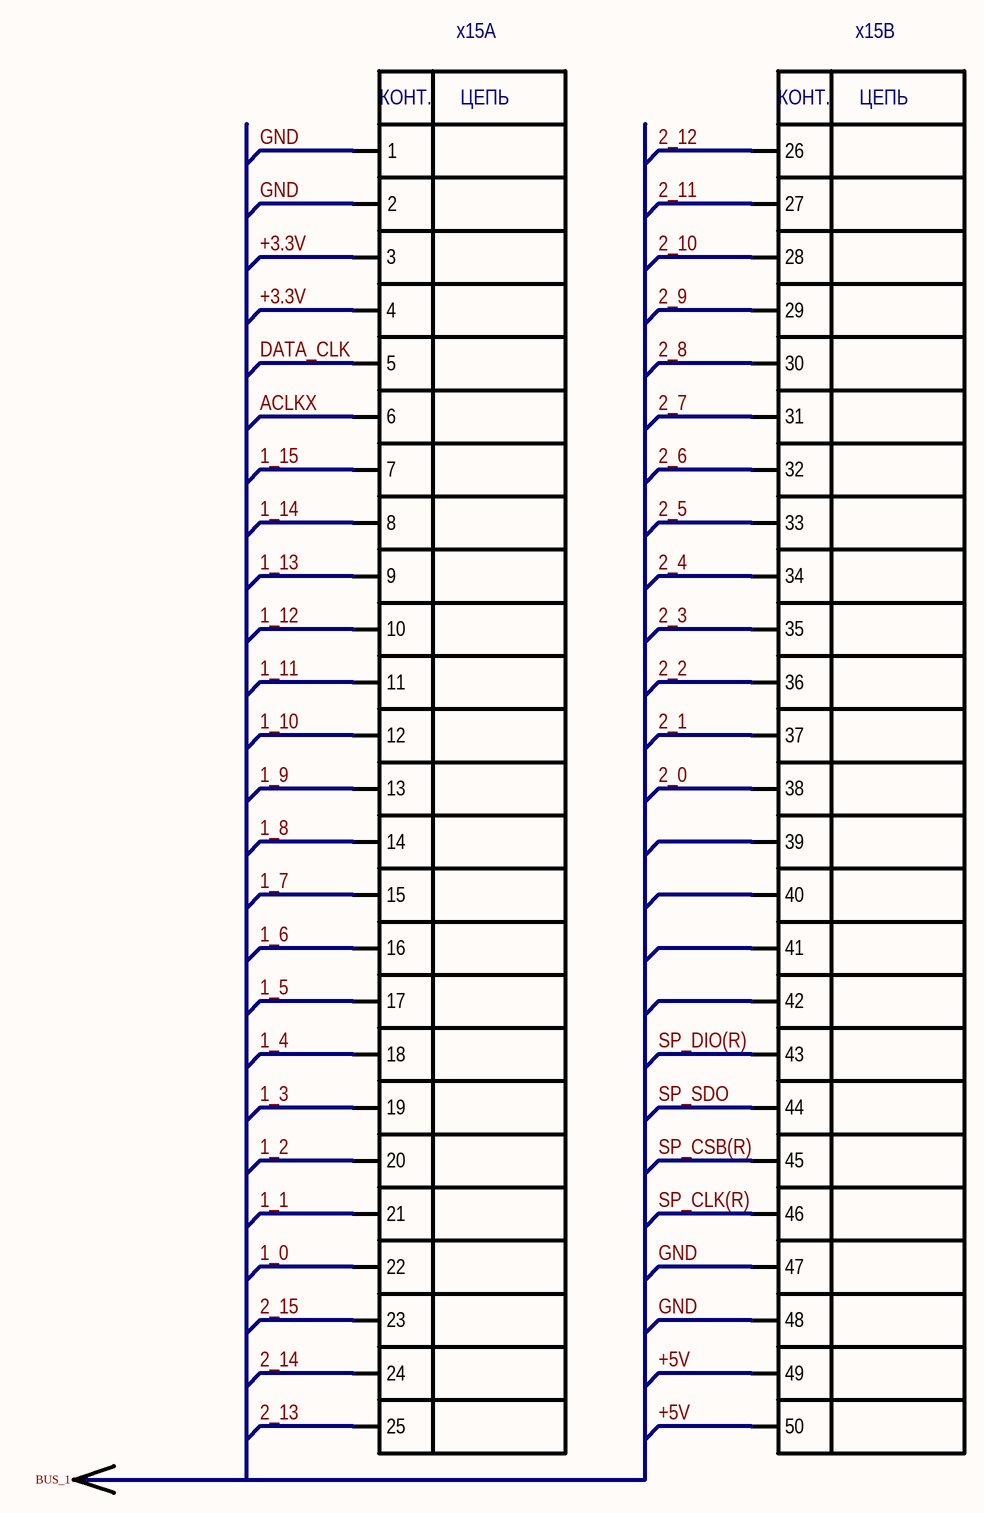
[diagram p2: AD9777(3).SchDoc]

### Parts
(Parts that share a designator on the sheet are numbered #1, #2 ... from top to bottom, then left to right.)
*?#81  VCC  (value not drawn)  (graphical)
x15  PBD-50  [PBD-50]  (value not drawn)  (parts A,B of 2)

### Nets
+3.3V: x15.3 x15.4
+5V: x15.49 x15.50
GND: x15.1 x15.2 x15.47 x15.48
1_0: x15.22
1_1: x15.21
1_2: x15.20
1_3: x15.19
1_4: x15.18
1_5: x15.17
1_6: x15.16
1_7: x15.15
1_8: x15.14
1_9: x15.13
1_10: x15.12
1_11: x15.11
1_12: x15.10
1_13: x15.9
1_14: x15.8
1_15: x15.7
2_0: x15.38
2_1: x15.37
2_2: x15.36
2_3: x15.35
2_4: x15.34
2_5: x15.33
2_6: x15.32
2_7: x15.31
2_8: x15.30
2_9: x15.29
2_10: x15.28
2_11: x15.27
2_12: x15.26
2_13: x15.25
2_14: x15.24
2_15: x15.23
ACLKX: x15.6
DATA_CLK: x15.5
SP_CLK(R): x15.46
SP_CSB(R): x15.45
SP_DIO(R): x15.43
SP_SDO: x15.44

Not connected (* = marked no-connect by the designer): x15 39 40 41 42

### Notes on the sheet
- Labels drawn without touching a wire or pin: BUS_1
- Подп. и дата
- Инв. № дубл.
- Взам. инв. №
- Инв. № подл.
- Лист
- Изм.
- № докум.
- Подп.
- Дата
- Копировал
- Формат А3
- (in symbol PBD-50, part A) КОНТ.; ЦЕПЬ
- (in symbol PBD-50, part B) КОНТ.; ЦЕПЬ

### Library data of the parts
*?#81 = VCC: as *?#1 on sheet AD9777
x15 = PBD-50: Гнездо на плату шаг 2.54мм., двухрядные; ManufacturerPartNumber: PBD50; BCPId: *; Rem: *; Package: *; TU/GOST: *; Type: Вилка; HelpURL: *; Price: *

## Nets that join several sheets
+3.3V: AD9777 (46 pins), AD9777(2) (17 pins), AD9777(3) (x15.3 x15.4)
+5V: AD9777 (8 pins), AD9777(3) (x15.49 x15.50)
GND: AD9777 (134 pins), AD9777(2) (22 pins), AD9777(3) (x15.1 x15.2 x15.47 x15.48)
1_0: AD9777 (R1.8 R3.4), AD9777(3) (x15.22)
1_1: AD9777 (R1.7 R3.3), AD9777(3) (x15.21)
1_2: AD9777 (R1.6 R3.2), AD9777(3) (x15.20)
1_3: AD9777 (R1.5 R3.1), AD9777(3) (x15.19)
1_4: AD9777 (R5.8 R7.4), AD9777(3) (x15.18)
1_5: AD9777 (R5.7 R7.3), AD9777(3) (x15.17)
1_6: AD9777 (R5.6 R7.2), AD9777(3) (x15.16)
1_7: AD9777 (R5.5 R7.1), AD9777(3) (x15.15)
1_8: AD9777 (R9.8 R11.4), AD9777(3) (x15.14)
1_9: AD9777 (R9.7 R11.3), AD9777(3) (x15.13)
1_10: AD9777 (R9.6 R11.2), AD9777(3) (x15.12)
1_11: AD9777 (R9.5 R11.1), AD9777(3) (x15.11)
1_12: AD9777 (R13.8 R15.4), AD9777(3) (x15.10)
1_13: AD9777 (R13.7 R15.3), AD9777(3) (x15.9)
1_14: AD9777 (R13.6 R15.2), AD9777(3) (x15.8)
1_15: AD9777 (R13.5 R15.1), AD9777(3) (x15.7)
2_0: AD9777 (R17.8 R19.4), AD9777(3) (x15.38)
2_1: AD9777 (R17.7 R19.3), AD9777(3) (x15.37)
2_2: AD9777 (R17.6 R19.2), AD9777(3) (x15.36)
2_3: AD9777 (R17.5 R19.1), AD9777(3) (x15.35)
2_4: AD9777 (R20.8 R22.4), AD9777(3) (x15.34)
2_5: AD9777 (R20.7 R22.3), AD9777(3) (x15.33)
2_6: AD9777 (R20.6 R22.2), AD9777(3) (x15.32)
2_7: AD9777 (R20.5 R22.1), AD9777(3) (x15.31)
2_8: AD9777 (R29.8 R31.4), AD9777(3) (x15.30)
2_9: AD9777 (R29.7 R31.3), AD9777(3) (x15.29)
2_10: AD9777 (R29.6 R31.2), AD9777(3) (x15.28)
2_11: AD9777 (R29.5 R31.1), AD9777(3) (x15.27)
2_12: AD9777 (R36.8 R38.4), AD9777(3) (x15.26)
2_13: AD9777 (R36.7 R38.3), AD9777(3) (x15.25)
2_14: AD9777 (R36.6 R38.2), AD9777(3) (x15.24)
2_15: AD9777 (R36.5 R38.1), AD9777(3) (x15.23)
ACLKX: AD9777 (x10.2), AD9777(2) (C51.1), AD9777(3) (x15.6)
CLK+: AD9777 (5 pins), AD9777(2) (x13.2)
CLK-: AD9777 (5 pins), AD9777(2) (x14.2)
DATA_CLK: AD9777 (C7.1 x11.1), AD9777(3) (x15.5)
SP_CLK(R): AD9777 (SPI_CLK.1), AD9777(2) (R53.1), AD9777(3) (x15.46)
SP_CSB(R): AD9777 (SPI_CSB.1), AD9777(2) (R54.1), AD9777(3) (x15.45)
SP_DIO(R): AD9777 (SPI_SDIO.1), AD9777(2) (R52.1), AD9777(3) (x15.43)
SP_SDO: AD9777 (SPI_SDO.1), AD9777(2) (D3.12), AD9777(3) (x15.44)
SPI_CLK: AD9777 (CLK.1 D1.55), AD9777(2) (D2.4)
SPI_CSB: AD9777 (CSB.1 D1.56), AD9777(2) (D2.2)
SPI_SDIO: AD9777 (D1.54 SDIO.1), AD9777(2) (D2.6)
SPI_SDO: AD9777 (D1.53 SDO.1), AD9777(2) (D3.1)